# EAGLE schematic SolarPwrOptions (EAGLE 7.6.0)
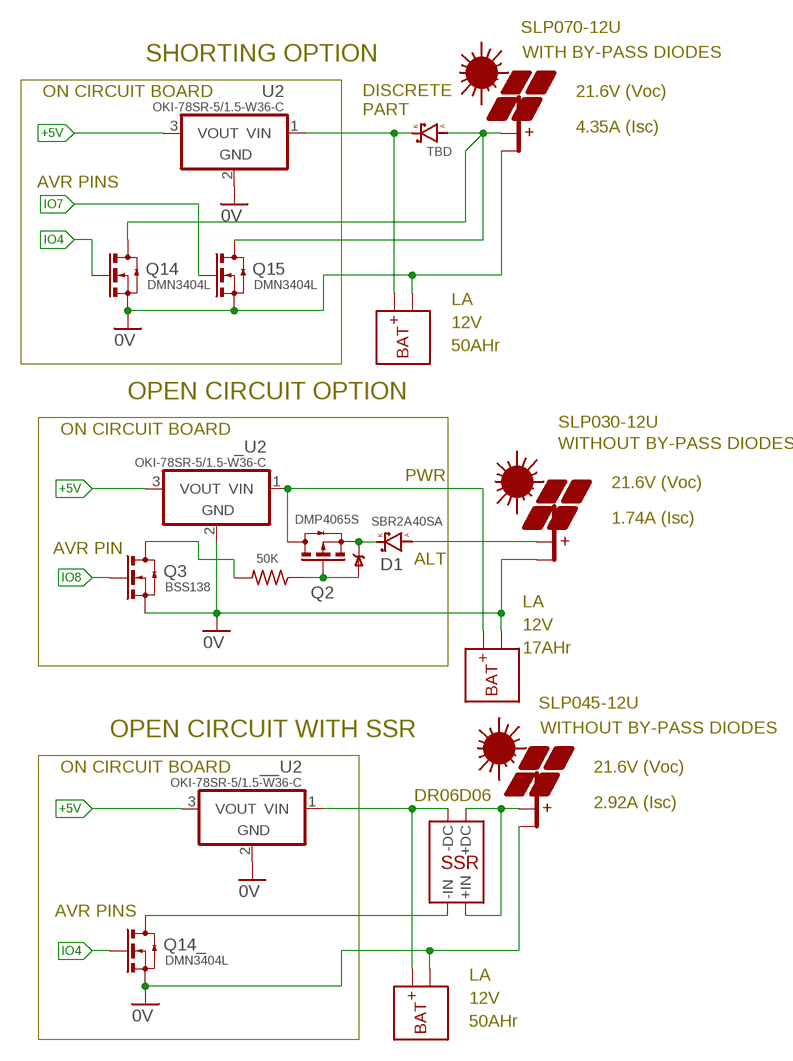
[diagram p0: schematic, sheet 1]

## Parts
__U2  OKI-78SR-5/1.5-W36-C  OKI-78SR-H  [OKI-78SR-H]
_D1  TBD  DSMB  [SMB]
_U2  OKI-78SR-5/1.5-W36-C  OKI-78SR-H  [OKI-78SR-H]
D1  SBR2A40SA  DSMB  [SMB]
D3  TVSSMC  [SMC]
PV1  PV  [NA-30]
PV2  PV  [NA-30]
PV3  PV  [NA-30]
Q2  DMP4065S  N-CHDPAK  [DPAK]
Q3  BSS138  N-CHDPAK  [DPAK]
Q14  DMN3404L  N-CHDPAK  [DPAK]
Q14_  DMN3404L  N-CHDPAK  [DPAK]
Q15  DMN3404L  N-CHDPAK  [DPAK]
R2  50K  R0805  [C0805(2012)]
U2  OKI-78SR-5/1.5-W36-C  OKI-78SR-H  [OKI-78SR-H]
U$1  BAT  [NA-30]
U$2  BAT  [NA-30]
U$3  SSR_DC  [NA-30]
U$10  BAT  [NA-30]

## Nets
0V: __U2.2(GND) _U2.2(GND) PV1.2(-PV) PV2.2(-PV) PV3.2(-PV) Q3.3(S) Q14.3(S) Q14_.3(S) Q15.3(S) U2.2(GND) U$1.2(-BAT) U$2.2(-BAT) U$10.2(-BAT)
+5V: __U2.3(VOUT) _U2.3(VOUT) U2.3(VOUT)
IO4: Q14.1(G) Q14_.1(G)
IO7: Q15.1(G)
IO8: Q3.1(G)
N$1: D1.K D3.C Q2.3(S)
N$2: _U2.1(VIN) Q2.SINK(D) U$1.1(+BAT)
N$3: D3.A Q2.1(G) R2.1
N$4: _D1.K U2.1(VIN) U$10.1(+BAT)
N$5: Q3.SINK(D) R2.2
N$6: __U2.1(VIN) U$2.1(+BAT) U$3.3(-DC)
N$7: D1.A PV2.1(+PV)
N$8: _D1.A PV1.1(+PV) Q14.SINK(D) Q15.SINK(D)
N$9: Q14_.SINK(D) U$3.4(-IN)
N$10: PV3.1(+PV) U$3.1(+DC) U$3.2(+IN)

## Notes on the sheet
- SLP070-12U
- SHORTING OPTION | WITH BY-PASS DIODES
- ON CIRCUIT BOARD | 21.6V (Voc)
- DISCRETE 
  PART
- 4.35A (Isc)
- AVR PINS
- LA
- 12V
- 50AHr
- OPEN CIRCUIT OPTION
- SLP030-12U
- ON CIRCUIT BOARD
- WITHOUT BY-PASS DIODES
- PWR
- 21.6V (Voc)
- 1.74A (Isc)
- AVR PIN
- ALT
- LA
- 12V
- 17AHr
- SLP045-12U
- OPEN CIRCUIT WITH SSR | WITHOUT BY-PASS DIODES
- ON CIRCUIT BOARD | 21.6V (Voc)
- DR06D06
- 2.92A (Isc)
- AVR PINS
- LA
- 12V
- 50AHr

## Library data of the parts
__U2 _U2 U2 = P-DCDC:OKI-78SR: OKI-78SR OKI-78SR-5/1.5-W36H-C 5V@1.5A Horizontal Mount OKI-78SR-5/1.5-W36-C 5V@1.5A Vert Mount OKI-78SR-3.3/1.5-W36H-C 3.3V@1.5A Horizontal Mount OKI-78SR-3.3/1.5-W36-C 3.3V@1.5A Vert Mount Murata Power Solutions 7 to 36 VDC input range need to verify pinout
_D1 D1 = D-SBR:D: DIODE
D3 = D-TVS:TVS: Transient Voltage Suppressors
PV1-PV3 = Documentation:PV
Q2 = Q-PCH:N-CH?*: ENHANCEMENT MODE MOSFET SOT23 is BSS138 pinout
Q3 Q14 Q14_ Q15 = Q-NCH:N-CH?*: ENHANCEMENT MODE MOSFET SOT23 is BSS138 pinout
R2 = R-C:R: Resiistor American-style symbol
U$1 U$2 U$10 = Documentation:BAT
U$3 = Documentation:SSR_DC: Crydom DR06D06 din mount 6A 4..32VIN 60Vload